# Altium schematic sheet HSD Enable Iso.SchDoc
size A4; SheetNumber: 5; SheetTotal: 8
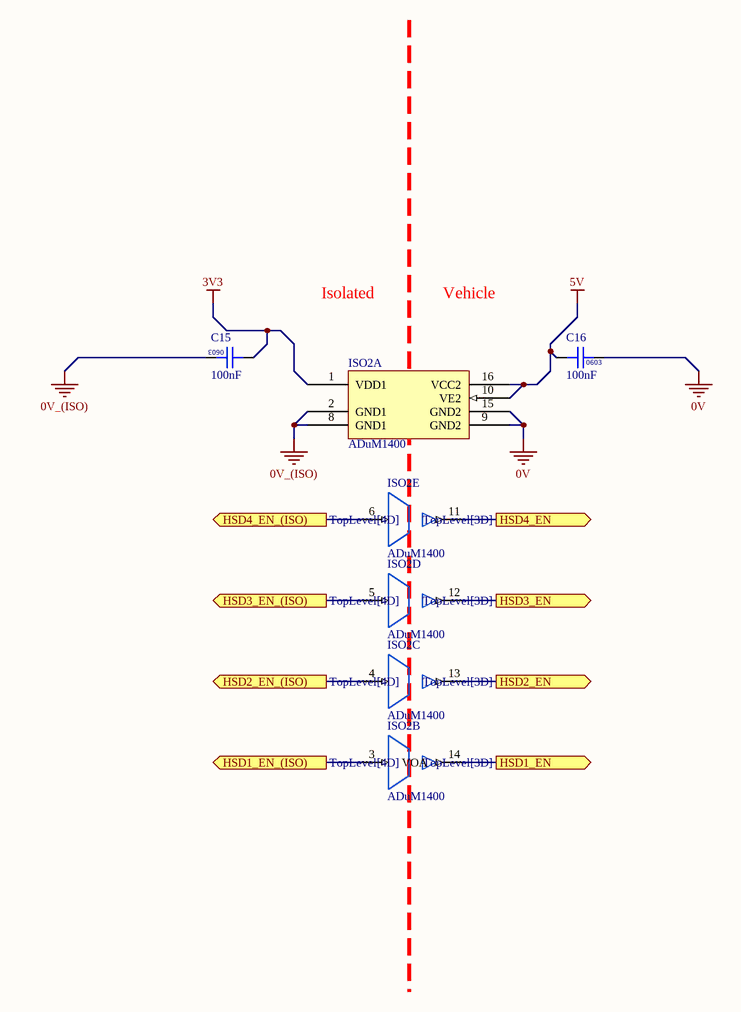
[diagram p0: HSD Enable Iso.SchDoc]

## Parts
C15  100nF  [0603]
C16  100nF  [0603]
ISO2  ADuM1400  [AD 16-SOIC]  (parts A,B,C,D,E of 5)

## Ports
HSD1_EN (out, see TopLevel[3D]), HSD1_EN_(ISO) (out, see TopLevel[4D]), HSD2_EN (out, see TopLevel[3D]), HSD2_EN_(ISO) (out, see TopLevel[4D]), HSD3_EN (out, see TopLevel[3D]), HSD3_EN_(ISO) (out, see TopLevel[4D]), HSD4_EN (out, see TopLevel[3D]), HSD4_EN_(ISO) (out, see TopLevel[4D])

## Nets
0V: C16.2 ISO2.9(GND2) ISO2.15(GND2)
0V_(ISO): C15.2 ISO2.2(GND1) ISO2.8(GND1)
3V3: C15.1 ISO2.1(VDD1)
5V: C16.1 ISO2.10(VE2) ISO2.16(VCC2)
HSD1_EN: ISO2.14(VOA) ; port HSD1_EN
HSD1_EN_(ISO): ISO2.3(VIA) ; port HSD1_EN_(ISO)
HSD2_EN: ISO2.13(VOB) ; port HSD2_EN
HSD2_EN_(ISO): ISO2.4(VIB) ; port HSD2_EN_(ISO)
HSD3_EN: ISO2.12(VOC) ; port HSD3_EN
HSD3_EN_(ISO): ISO2.5(VIC) ; port HSD3_EN_(ISO)
HSD4_EN: ISO2.11(VOD) ; port HSD4_EN
HSD4_EN_(ISO): ISO2.6(VID) ; port HSD4_EN_(ISO)

## Notes on the sheet
- Isolated
- Vehicle
- (in symbol GCM188L81H104KA57D) 0603

## Library data of the parts
C15 C16 = GCM188L81H104KA57D: Manufacturer: muRata; Rated Voltage: 50V; Tolerance: ±10%; Material: MLCC; Temperature Rating: X8L; Part Number: GCM188L81H104KA57D; Value: 100nF; Digikey Part Number: 490-6049-1-ND
ISO2 = ADuM1400: General Purpose Digital Isolator 2500Vrms 4 Channel 1Mbps 25kV/µs CMTI 16-SOIC (0.295", 7.50mm Width); Manufacturer: Analog Devices; Complex IC: 0; Part Number: ADuM1400; Digikey Part Number: ADUM1400WSRWZ-ND; Digikey Link: https://www.digikey.com/product-detail/en/analog-devices-inc/ADUM1400WSRWZ/ADUM1400WSRWZ-ND/1873713